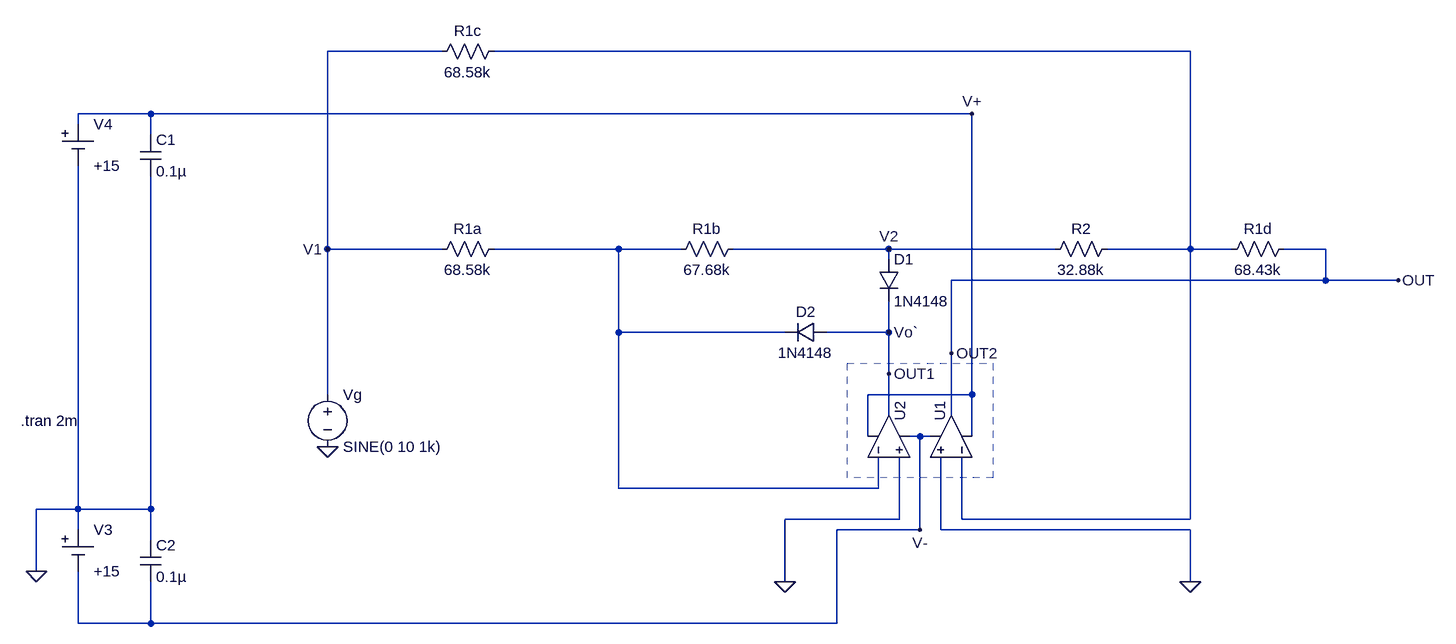
[diagram p0: schematic Circuito5.asc]
Circuito5.asc, the LTspice schematic file:
Version 4
SHEET 1 996 776
WIRE -976 -112 -1152 -112
WIRE 176 -112 -896 -112
WIRE -1424 -16 -1536 -16
WIRE -160 -16 -1424 -16
WIRE -1536 0 -1536 -16
WIRE -1424 16 -1424 -16
WIRE -1152 192 -1152 -112
WIRE -976 192 -1152 192
WIRE -704 192 -896 192
WIRE -608 192 -704 192
WIRE -288 192 -528 192
WIRE -32 192 -288 192
WIRE 176 192 176 -112
WIRE 176 192 48 192
WIRE 240 192 176 192
WIRE 384 192 320 192
WIRE -288 208 -288 192
WIRE 384 240 384 192
WIRE 384 240 -192 240
WIRE 496 240 384 240
WIRE -704 320 -704 192
WIRE -448 320 -704 320
WIRE -288 320 -288 272
WIRE -288 320 -384 320
WIRE -192 352 -192 240
WIRE -288 384 -288 320
WIRE -1152 416 -1152 192
WIRE -160 416 -160 -16
WIRE -160 416 -320 416
WIRE -288 448 -288 384
WIRE -192 448 -192 352
WIRE -320 480 -320 416
WIRE -240 480 -256 480
WIRE -224 480 -240 480
WIRE -160 480 -160 416
WIRE -704 560 -704 320
WIRE -304 560 -304 512
WIRE -304 560 -704 560
WIRE -1536 592 -1536 64
WIRE -1536 592 -1600 592
WIRE -1424 592 -1424 80
WIRE -1424 592 -1536 592
WIRE -272 608 -272 512
WIRE -272 608 -448 608
WIRE -176 608 -176 512
WIRE 176 608 176 192
WIRE 176 608 -176 608
WIRE -1536 624 -1536 592
WIRE -240 624 -240 480
WIRE -240 624 -368 624
WIRE -208 624 -208 512
WIRE 176 624 -208 624
WIRE -1424 640 -1424 592
WIRE -1600 688 -1600 592
WIRE -448 704 -448 608
WIRE 176 704 176 624
WIRE -1536 768 -1536 688
WIRE -1424 768 -1424 704
WIRE -1424 768 -1536 768
WIRE -368 768 -368 624
WIRE -368 768 -1424 768
FLAG -1600 688 0
FLAG -1152 496 0
FLAG -448 704 0
FLAG 176 704 0
FLAG 496 240 OUT
FLAG -192 352 OUT2
FLAG -288 384 OUT1
FLAG -288 192 V2
FLAG -160 -16 V+
FLAG -240 624 V-
FLAG -1152 192 V1
FLAG -288 320 Vo`
SYMBOL cap -1440 640 R0
SYMATTR InstName C2
SYMATTR Value 0.1µ
SYMBOL Misc\\cell -1536 624 R0
WINDOW 123 0 0 Left 0
WINDOW 39 0 0 Left 0
SYMATTR InstName V3
SYMATTR Value +15
SYMBOL Misc\\cell -1536 0 R0
WINDOW 123 0 0 Left 0
WINDOW 39 0 0 Left 0
SYMATTR InstName V4
SYMATTR Value +15
SYMBOL cap -1440 16 R0
SYMATTR InstName C1
SYMATTR Value 0.1µ
SYMBOL Opamps/UniversalOpamp2 -288 480 R270
WINDOW 0 23 17 Left 2
SYMATTR InstName U2
SYMBOL Opamps/UniversalOpamp2 -192 480 M270
WINDOW 0 23 17 Left 2
SYMATTR InstName U1
SYMBOL voltage -1152 400 R0
WINDOW 123 0 0 Left 0
WINDOW 39 0 0 Left 0
SYMATTR InstName Vg
SYMATTR Value SINE(0 10 1k)
SYMBOL res -880 176 R90
WINDOW 0 0 56 VBottom 2
WINDOW 3 32 56 VTop 2
SYMATTR InstName R1a
SYMATTR Value 68.58k
SYMBOL res -880 -128 R90
WINDOW 0 0 56 VBottom 2
WINDOW 3 32 56 VTop 2
SYMATTR InstName R1c
SYMATTR Value 68.58k
SYMBOL res -512 176 R90
WINDOW 0 0 56 VBottom 2
WINDOW 3 32 56 VTop 2
SYMATTR InstName R1b
SYMATTR Value 67.68k
SYMBOL diode -304 208 R0
SYMATTR InstName D1
SYMATTR Value 1N4148
SYMBOL res 64 176 R90
WINDOW 0 0 56 VBottom 2
WINDOW 3 32 56 VTop 2
SYMATTR InstName R2
SYMATTR Value 32.88k
SYMBOL res 336 176 R90
WINDOW 0 0 56 VBottom 2
WINDOW 3 32 56 VTop 2
SYMATTR InstName R1d
SYMATTR Value 68.43k
SYMBOL diode -384 304 R90
WINDOW 0 0 32 VBottom 2
WINDOW 3 32 32 VTop 2
SYMATTR InstName D2
SYMATTR Value 1N4148
TEXT -1624 456 Left 2 !.tran 2m
RECTANGLE Normal -128 544 -352 368 2

The netlist it stands for:
* Circuito5.asc
C2 0 V- 0.1µ
V3 0 V- +15
V4 V+ 0 +15
C1 V+ 0 0.1µ
XU2 0 N002 V+ V- Vo` level.2 Avol=1Meg GBW=10Meg Slew=10Meg ilimit=25m rail=0 Vos=0 phimargin=45 en=0 enk=0 in=0 ink=0 Rin=500Meg  ; pins IN+ IN- V+ V- OUT
XU1 0 N001 V+ V- OUT2 level.2 Avol=1Meg GBW=10Meg Slew=10Meg ilimit=25m rail=0 Vos=0 phimargin=45 en=0 enk=0 in=0 ink=0 Rin=500Meg  ; pins IN+ IN- V+ V- OUT
Vg V1 0 SINE(0 10 1k)
R1a N002 V1 68.58k
R1c N001 V1 68.58k
R1b V2 N002 67.68k
D1 V2 Vo` 1N4148
R2 N001 V2 32.88k
R1d OUT2 N001 68.43k
D2 Vo` N002 1N4148
.model D D
.lib standard.dio
.tran 2m
.lib UniversalOpamps2.sub
.backanno
.end